# Altium project MB1428.PrjPcb (part 1 of 4)
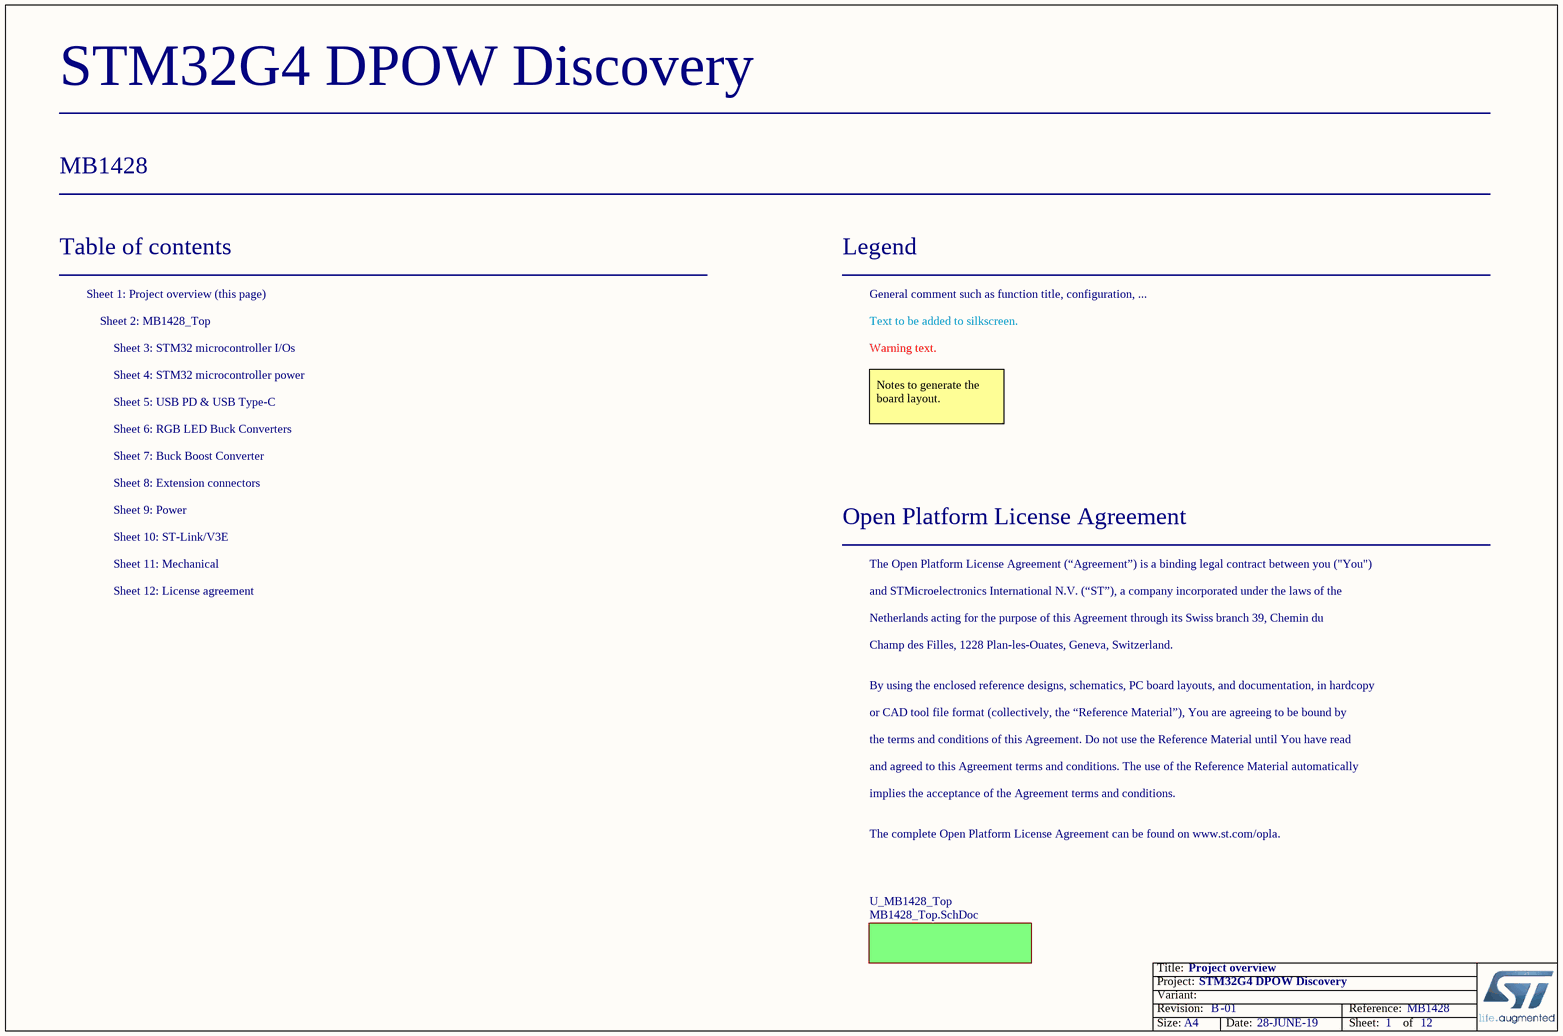
[diagram p0: Project_Overview.SchDoc]
Board_Assembly_Revision: 01; Board_Document_Date: 28-JUNE-19; Board_Name: STM32G4 DPOW Discovery; Board_PCB_Revision: B; Board_Reference: MB1428
11 sheets, 403 parts. Net scope: flat (ports and power ports of the same name join across sheets).
Board file: MB1428.PcbDoc
Sheets:
  Project_Overview.SchDoc
    U_MB1428_Top = MB1428_Top.SchDoc
      U_Extension_connectors = Extension_connectors.SchDoc
      U_Power = Power.SchDoc
      U_STM32_microcontroller_IOs = STM32_microcontroller_IOs.SchDoc
      U_STM32_microcontroller_power = STM32_microcontroller_power.SchDoc
      U_ST_LINK_V3E = ST_LINK_V3E.SchDoc
      Mechanical = Mechanical.SchDoc
      U_USB_PD_TYPE-C = USB_PD_TYPE-C.SchDoc
      U_RGB_LED_BUCK_Converters = RGB_LED_BUCK_Converters.SchDoc
      U_BUCK_BOOST_Converter = BUCK_BOOST_Converter.SchDoc

## Sheet Project_Overview.SchDoc: Project overview
size A4; Date: Not used; ApprovedBy: Not used; CheckedBy: Not used; Author: Not used; CompanyName: STMicroelectronics; DrawnBy: Not used; Engineer: Not used; Organization: Not used; Address1: Not used; Address2: Not used; Address3: Not used; Address4: Not used; DocumentNumber: Not used; Revision: Not used; SheetNumber: 1; SheetTotal: 12; CurrentTime: Not used; CurrentDate: Not used; Time: Not used; DocumentFullPathAndName: Not used; DocumentName: Not used; ModifiedDate: Not used; ImagePath: Not used; ProjectName: Not used; Application_BuildNumber: Not used

### Sub-sheets
U_MB1428_Top = MB1428_Top.SchDoc: no entries

### Notes on the sheet
- Table of contents
- Sheet 1: Project overview (this page)
- Legend
- General comment such as function title, configuration, ...
- Sheet 2: MB1428_Top
- Sheet 3: STM32 microcontroller I/Os
- Sheet 4: STM32 microcontroller power
- Text to be added to silkscreen.
- Warning text.
- Sheet 6: RGB LED Buck Converters
- Sheet 5: USB PD & USB Type-C
- Notes to generate the board layout.
- Sheet 9: Power
- Sheet 8: Extension connectors
- Sheet 7: Buck Boost Converter
- Sheet 10: ST-Link/V3E
- Sheet 11: Mechanical
- Open Platform License Agreement
- The Open Platform License Agreement (“Agreement”) is a binding legal contract between you ("You")
- Sheet 12: License agreement
- and STMicroelectronics International N.V. (“ST”), a company incorporated under the laws of the
- Netherlands acting for the purpose of this Agreement through its Swiss branch 39, Chemin du
- Champ des Filles, 1228 Plan-les-Ouates, Geneva, Switzerland.
- By using the enclosed reference designs, schematics, PC board layouts, and documentation, in hardcopy
- or CAD tool file format (collectively, the “Reference Material”), You are agreeing to be bound by
- the terms and conditions of this Agreement. Do not use the Reference Material until You have read
- and agreed to this Agreement terms and conditions. The use of the Reference Material automatically
- implies the acceptance of the Agreement terms and conditions.
- The complete Open Platform License Agreement can be found on www.st.com/opla.
- Title:
- Project:
- Size:
- Revision:
- Variant:
- A4
- -
- Date:
- Reference:
- Sheet:
- of

## Sheet MB1428_Top.SchDoc: MB1428_Top
size A4; Date: Not used; ApprovedBy: Not used; CheckedBy: Not used; Author: Not used; CompanyName: STMicroelectronics; DrawnBy: Not used; Engineer: Not used; Organization: Not used; Address1: Not used; Address2: Not used; Address3: Not used; Address4: Not used; DocumentNumber: Not used; Revision: Not used; SheetNumber: 2; SheetTotal: 12; CurrentTime: Not used; CurrentDate: Not used; Time: Not used; DocumentFullPathAndName: Not used; DocumentName: Not used; ModifiedDate: Not used; ImagePath: Not used; ProjectName: Not used; Application_BuildNumber: Not used
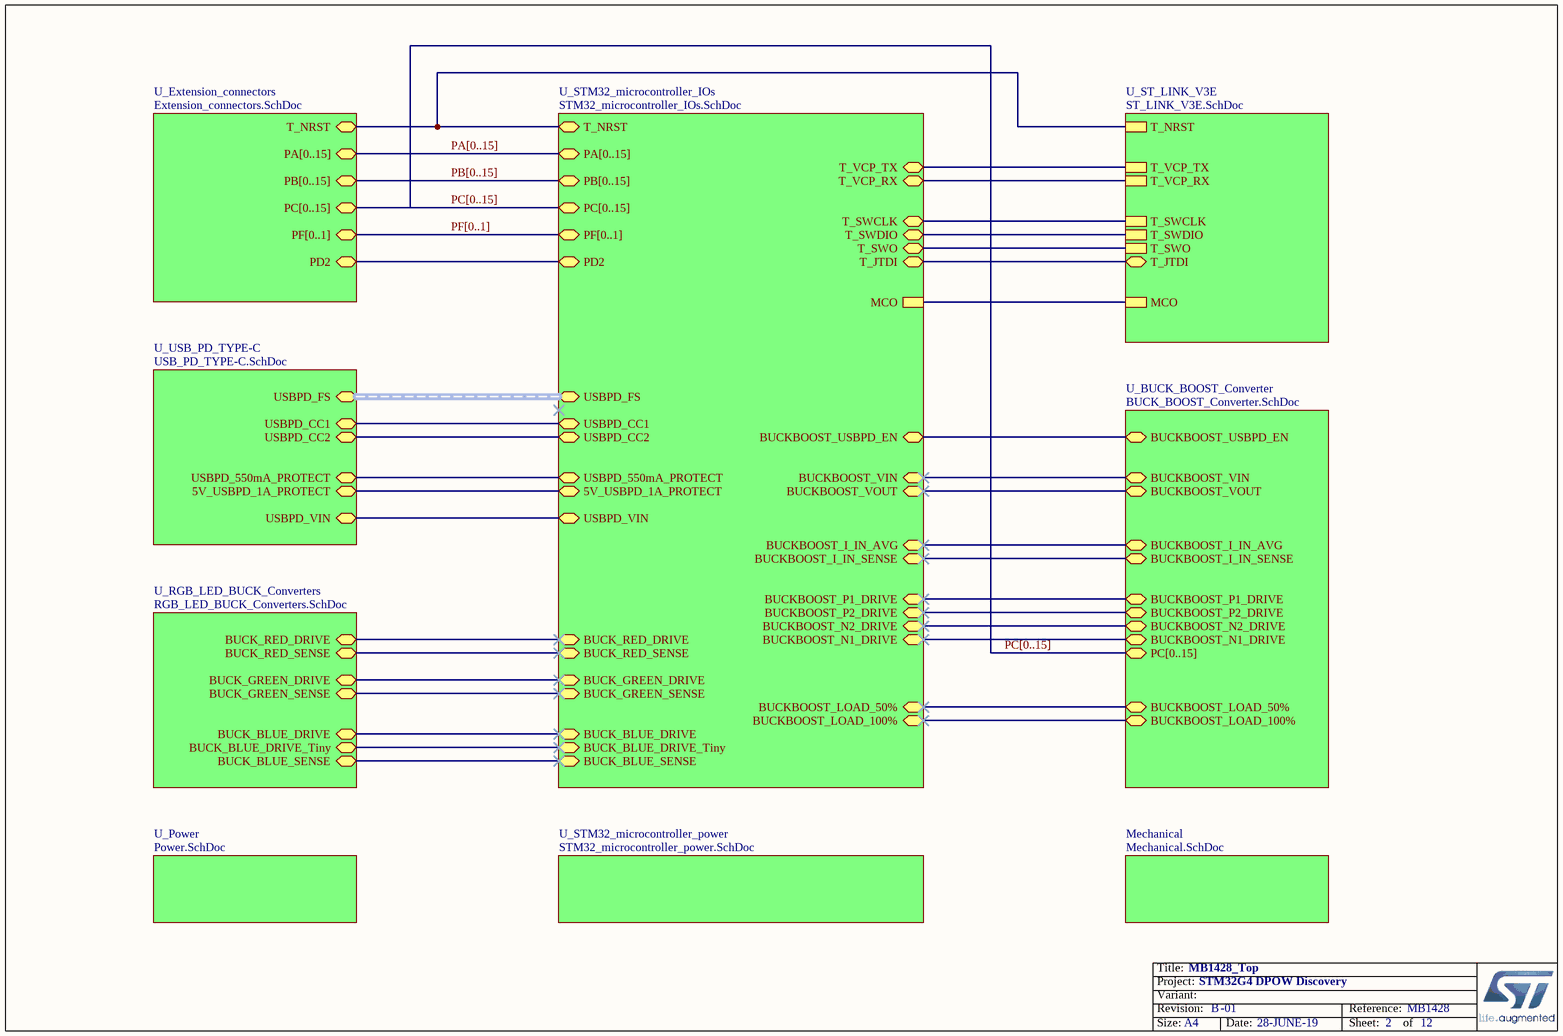
[diagram p1: MB1428_Top.SchDoc]

### Sub-sheets
Mechanical = Mechanical.SchDoc: no entries
U_BUCK_BOOST_Converter = BUCK_BOOST_Converter.SchDoc: PC[0..15] (bidir), BUCKBOOST_USBPD_EN, BUCKBOOST_VOUT, BUCKBOOST_VIN, BUCKBOOST_I_IN_SENSE, BUCKBOOST_I_IN_AVG, BUCKBOOST_P2_DRIVE, BUCKBOOST_P1_DRIVE, BUCKBOOST_N1_DRIVE, BUCKBOOST_N2_DRIVE, BUCKBOOST_LOAD_100%, BUCKBOOST_LOAD_50%
U_Extension_connectors = Extension_connectors.SchDoc: PA[0..15] (bidir), PB[0..15] (bidir), PC[0..15] (bidir), PF[0..1] (bidir), T_NRST, PD2
U_Power = Power.SchDoc: no entries
U_RGB_LED_BUCK_Converters = RGB_LED_BUCK_Converters.SchDoc: BUCK_GREEN_SENSE, BUCK_RED_DRIVE, BUCK_RED_SENSE, BUCK_GREEN_DRIVE, BUCK_BLUE_DRIVE, BUCK_BLUE_DRIVE_Tiny, BUCK_BLUE_SENSE
U_ST_LINK_V3E = ST_LINK_V3E.SchDoc: T_SWCLK, T_SWO, T_NRST, MCO, T_SWDIO, T_VCP_TX, T_VCP_RX, T_JTDI
U_STM32_microcontroller_IOs = STM32_microcontroller_IOs.SchDoc: PA[0..15] (bidir), PB[0..15] (bidir), PC[0..15] (bidir), PF[0..1] (bidir), MCO, PD2, T_NRST, T_VCP_TX, T_VCP_RX, T_SWCLK, T_SWO, T_SWDIO, T_JTDI, BUCKBOOST_USBPD_EN, BUCKBOOST_VIN, BUCKBOOST_VOUT, BUCKBOOST_I_IN_AVG, BUCKBOOST_I_IN_SENSE, BUCKBOOST_P2_DRIVE, BUCKBOOST_P1_DRIVE, BUCKBOOST_N1_DRIVE, BUCKBOOST_N2_DRIVE, BUCKBOOST_LOAD_100%, BUCKBOOST_LOAD_50%, USBPD_CC1, USBPD_CC2, 5V_USBPD_1A_PROTECT, USBPD_550mA_PROTECT, BUCK_GREEN_SENSE, BUCK_RED_DRIVE, BUCK_RED_SENSE, BUCK_GREEN_DRIVE, BUCK_BLUE_DRIVE, BUCK_BLUE_DRIVE_Tiny, BUCK_BLUE_SENSE, USBPD_FS (harness USBPDFS), USBPD_VIN
U_STM32_microcontroller_power = STM32_microcontroller_power.SchDoc: no entries
U_USB_PD_TYPE-C = USB_PD_TYPE-C.SchDoc: 5V_USBPD_1A_PROTECT, USBPD_CC1, USBPD_CC2, USBPD_550mA_PROTECT, USBPD_FS (harness USBPDFS), USBPD_VIN

### Nets
(unnamed): sheet U_Extension_connectors/T_NRST, sheet U_STM32_microcontroller_IOs/T_NRST, sheet U_ST_LINK_V3E/T_NRST
(unnamed): sheet U_Extension_connectors/PD2, sheet U_STM32_microcontroller_IOs/PD2
(unnamed): sheet U_STM32_microcontroller_IOs/MCO, sheet U_ST_LINK_V3E/MCO
(unnamed): sheet U_STM32_microcontroller_IOs/T_VCP_TX, sheet U_ST_LINK_V3E/T_VCP_TX
(unnamed): sheet U_STM32_microcontroller_IOs/T_VCP_RX, sheet U_ST_LINK_V3E/T_VCP_RX
(unnamed): sheet U_STM32_microcontroller_IOs/T_SWCLK, sheet U_ST_LINK_V3E/T_SWCLK
(unnamed): sheet U_STM32_microcontroller_IOs/T_SWO, sheet U_ST_LINK_V3E/T_SWO
(unnamed): sheet U_STM32_microcontroller_IOs/T_SWDIO, sheet U_ST_LINK_V3E/T_SWDIO
(unnamed): sheet U_STM32_microcontroller_IOs/T_JTDI, sheet U_ST_LINK_V3E/T_JTDI
(unnamed): sheet U_STM32_microcontroller_IOs/BUCKBOOST_USBPD_EN, sheet U_BUCK_BOOST_Converter/BUCKBOOST_USBPD_EN
(unnamed): sheet U_STM32_microcontroller_IOs/BUCKBOOST_VIN, sheet U_BUCK_BOOST_Converter/BUCKBOOST_VIN
(unnamed): sheet U_STM32_microcontroller_IOs/BUCKBOOST_VOUT, sheet U_BUCK_BOOST_Converter/BUCKBOOST_VOUT
(unnamed): sheet U_STM32_microcontroller_IOs/BUCKBOOST_I_IN_AVG, sheet U_BUCK_BOOST_Converter/BUCKBOOST_I_IN_AVG
(unnamed): sheet U_STM32_microcontroller_IOs/BUCKBOOST_I_IN_SENSE, sheet U_BUCK_BOOST_Converter/BUCKBOOST_I_IN_SENSE
(unnamed): sheet U_STM32_microcontroller_IOs/BUCKBOOST_P2_DRIVE, sheet U_BUCK_BOOST_Converter/BUCKBOOST_P2_DRIVE
(unnamed): sheet U_STM32_microcontroller_IOs/BUCKBOOST_P1_DRIVE, sheet U_BUCK_BOOST_Converter/BUCKBOOST_P1_DRIVE
(unnamed): sheet U_STM32_microcontroller_IOs/BUCKBOOST_N1_DRIVE, sheet U_BUCK_BOOST_Converter/BUCKBOOST_N1_DRIVE
(unnamed): sheet U_STM32_microcontroller_IOs/BUCKBOOST_N2_DRIVE, sheet U_BUCK_BOOST_Converter/BUCKBOOST_N2_DRIVE
(unnamed): sheet U_STM32_microcontroller_IOs/BUCKBOOST_LOAD_100%, sheet U_BUCK_BOOST_Converter/BUCKBOOST_LOAD_100%
(unnamed): sheet U_STM32_microcontroller_IOs/BUCKBOOST_LOAD_50%, sheet U_BUCK_BOOST_Converter/BUCKBOOST_LOAD_50%
(unnamed): sheet U_STM32_microcontroller_IOs/USBPD_CC1, sheet U_USB_PD_TYPE-C/USBPD_CC1
(unnamed): sheet U_STM32_microcontroller_IOs/USBPD_CC2, sheet U_USB_PD_TYPE-C/USBPD_CC2
(unnamed): sheet U_STM32_microcontroller_IOs/5V_USBPD_1A_PROTECT, sheet U_USB_PD_TYPE-C/5V_USBPD_1A_PROTECT
(unnamed): sheet U_STM32_microcontroller_IOs/USBPD_550mA_PROTECT, sheet U_USB_PD_TYPE-C/USBPD_550mA_PROTECT
(unnamed): sheet U_STM32_microcontroller_IOs/BUCK_GREEN_SENSE, sheet U_RGB_LED_BUCK_Converters/BUCK_GREEN_SENSE
(unnamed): sheet U_STM32_microcontroller_IOs/BUCK_RED_DRIVE, sheet U_RGB_LED_BUCK_Converters/BUCK_RED_DRIVE
(unnamed): sheet U_STM32_microcontroller_IOs/BUCK_RED_SENSE, sheet U_RGB_LED_BUCK_Converters/BUCK_RED_SENSE
(unnamed): sheet U_STM32_microcontroller_IOs/BUCK_GREEN_DRIVE, sheet U_RGB_LED_BUCK_Converters/BUCK_GREEN_DRIVE
(unnamed): sheet U_STM32_microcontroller_IOs/BUCK_BLUE_DRIVE, sheet U_RGB_LED_BUCK_Converters/BUCK_BLUE_DRIVE
(unnamed): sheet U_STM32_microcontroller_IOs/BUCK_BLUE_DRIVE_Tiny, sheet U_RGB_LED_BUCK_Converters/BUCK_BLUE_DRIVE_Tiny
(unnamed): sheet U_STM32_microcontroller_IOs/BUCK_BLUE_SENSE, sheet U_RGB_LED_BUCK_Converters/BUCK_BLUE_SENSE
(unnamed): sheet U_STM32_microcontroller_IOs/USBPD_VIN, sheet U_USB_PD_TYPE-C/USBPD_VIN

### Buses and harness runs
bus PA[0..15] = sheet U_Extension_connectors/PA[0..15] = sheet U_STM32_microcontroller_IOs/PA[0..15]
bus PB[0..15] = sheet U_Extension_connectors/PB[0..15] = sheet U_STM32_microcontroller_IOs/PB[0..15]
bus PC[0..15] = sheet U_BUCK_BOOST_Converter/PC[0..15] = sheet U_Extension_connectors/PC[0..15] = sheet U_STM32_microcontroller_IOs/PC[0..15]
bus PF[0..1] = sheet U_Extension_connectors/PF[0..1] = sheet U_STM32_microcontroller_IOs/PF[0..1]
harness sheet U_STM32_microcontroller_IOs/USBPD_FS = sheet U_USB_PD_TYPE-C/USBPD_FS

### Notes on the sheet
- Cuttable part on PCB
- Title:
- Project:
- Size:
- Revision:
- Variant:
- A4
- -
- Date:
- Reference:
- Sheet:
- of

## Sheet Extension_connectors.SchDoc: Extension_connectors
size A4; Date: Not used; ApprovedBy: Not used; CheckedBy: Not used; Author: Not used; CompanyName: STMicroelectronics; DrawnBy: Not used; Engineer: Not used; Organization: Not used; Address1: Not used; Address2: Not used; Address3: Not used; Address4: Not used; DocumentNumber: Not used; Revision: Not used; SheetNumber: 8; SheetTotal: 12; CurrentTime: Not used; CurrentDate: Not used; Time: Not used; DocumentFullPathAndName: Not used; DocumentName: Not used; ModifiedDate: Not used; ImagePath: Not used; ProjectName: Not used; Application_BuildNumber: Not used
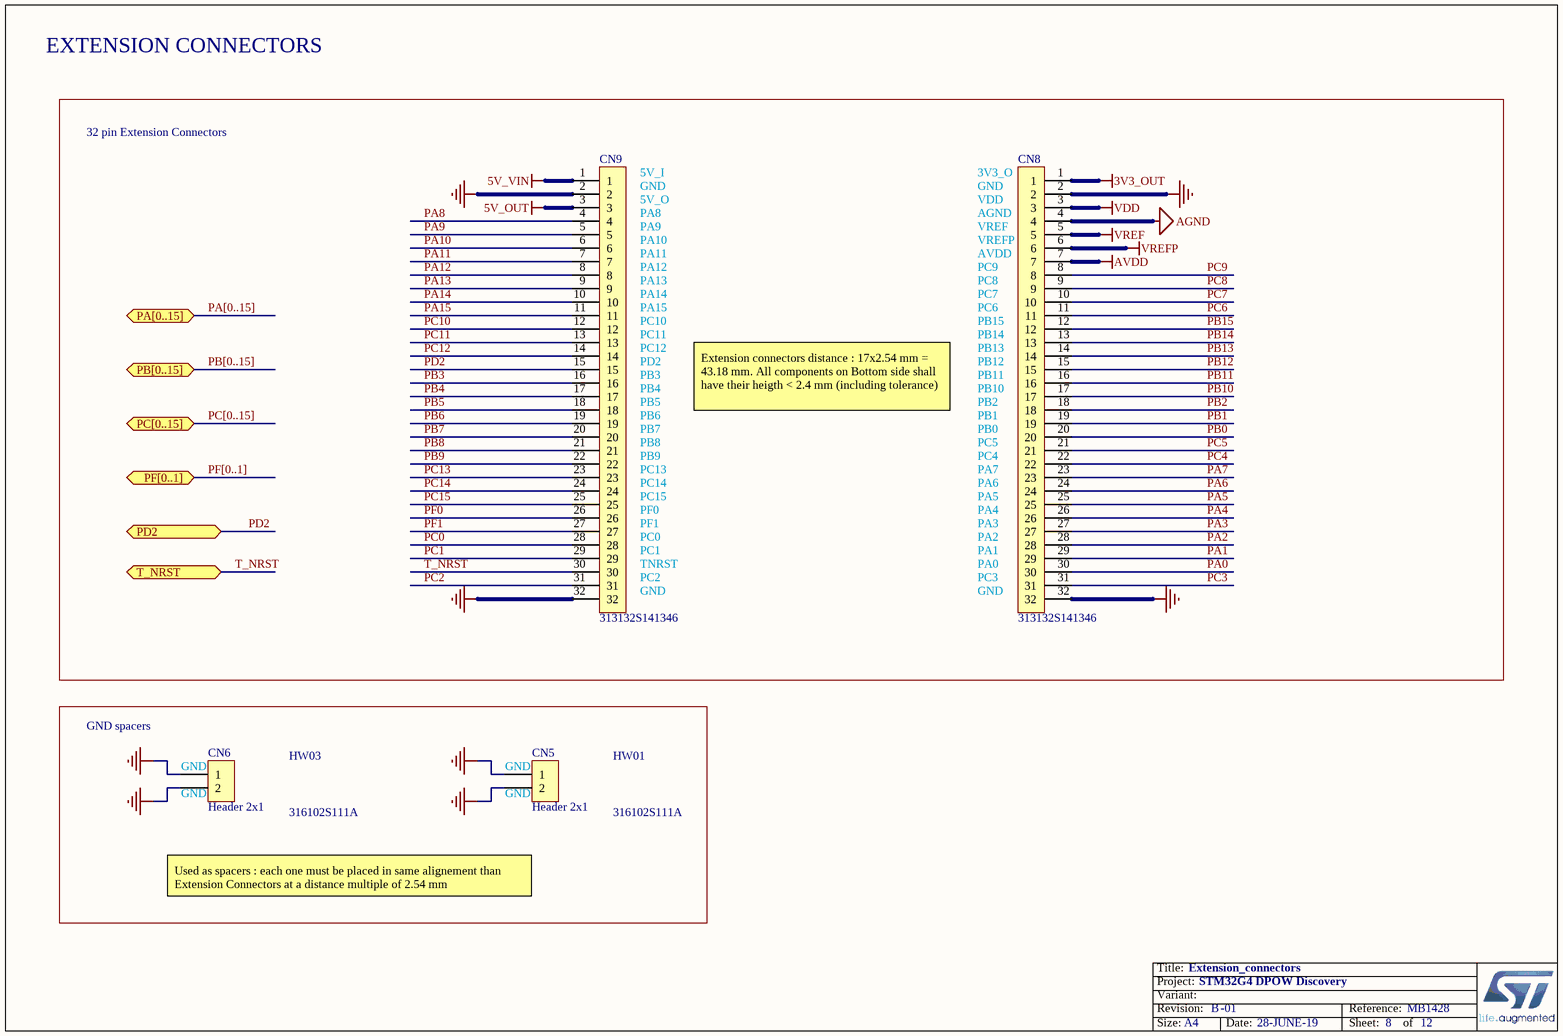
[diagram p2: Extension_connectors.SchDoc]

### Parts
CN5  Header 2x1  [CON_LYCONN_313102S141346]
CN6  Header 2x1  [CON_LYCONN_313102S141346]
CN8  value 313132S141346  [CON_LYCONN_313132S141346]  (hidden comment: Header 32x1)
CN9  value 313132S141346  [CON_LYCONN_313132S141346]  (hidden comment: Header 32x1)
HW01  value 316102S111A  (hidden comment: JUMPER_OPEN)
HW03  value 316102S111A  (hidden comment: JUMPER_OPEN)

### Ports
PA[0..15] (bidir), PB[0..15] (bidir), PC[0..15] (bidir), PD2, PF[0..1] (bidir), T_NRST

### Nets
3V3_OUT: CN8.1
5V_OUT: CN9.3
5V_VIN: CN9.1
AGND: CN8.4
AVDD: CN8.7
GND: CN5.1 CN5.2 CN6.1 CN6.2 CN8.2 CN8.32 CN9.2 CN9.32
VDD: CN8.3
VREF: CN8.5
VREFP: CN8.6
PA0: CN8.30  [project net BUCK_GREEN_SENSE]
PA1: CN8.29  [project net BUCKBOOST_VIN]
PA2: CN8.28
PA3: CN8.27  [project net BUCKBOOST_VOUT]
PA4: CN8.26
PA5: CN8.25
PA6: CN8.24
PA7: CN8.23  [project net BUCK_RED_SENSE]
PA8: CN9.4  [project net BUCK_BLUE_DRIVE]
PA9: CN9.5
PA10: CN9.6
PA11: CN9.7
PA12: CN9.8
PA13: CN9.9
PA14: CN9.10
PA15: CN9.11
PB0: CN8.20  [project net BUCK_BLUE_SENSE]
PB1: CN8.19
PB2: CN8.18
PB3: CN9.16
PB4: CN9.17
PB5: CN9.18
PB6: CN9.19
PB7: CN9.20
PB8: CN9.21
PB9: CN9.22
PB10: CN8.17
PB11: CN8.16
PB12: CN8.15  [project net BUCKBOOST_P1_DRIVE]
PB13: CN8.14  [project net BUCKBOOST_N1_DRIVE]
PB14: CN8.13  [project net BUCKBOOST_N2_DRIVE]
PB15: CN8.12  [project net BUCKBOOST_P2_DRIVE]
PC0: CN9.28
PC1: CN9.29
PC2: CN9.31
PC3: CN8.31
PC4: CN8.22
PC5: CN8.21
PC6: CN8.11  [project net BUCK_RED_DRIVE]
PC7: CN8.10
PC8: CN8.9  [project net BUCK_GREEN_DRIVE]
PC9: CN8.8  [project net BUCK_BLUE_DRIVE_Tiny]
PC10: CN9.12
PC11: CN9.13
PC12: CN9.14
PC13: CN9.23
PC14: CN9.24  [project net BUCKBOOST_LOAD_50%]
PC15: CN9.25  [project net BUCKBOOST_LOAD_100%]
PD2: CN9.15 ; port PD2
PF0: CN9.26
PF1: CN9.27
T_NRST: CN9.30 ; port T_NRST

### Buses and harness runs
bus PA[0..15] = port PA[0..15]
bus PB[0..15] = port PB[0..15]
bus PC[0..15] = port PC[0..15]
bus PF[0..1] = port PF[0..1]

### Notes on the sheet
- EXTENSION CONNECTORS
- 32 pin Extension Connectors
- (near CN9) 5V_I
- (near CN8) 3V3_O
- (near CN9) GND
- (near CN9) 5V_O
- (near CN9) PA8
- (near CN9) PA10
- (near CN9) PA9
- (near CN8) GND
- (near CN8) VDD
- (near CN8) VREF
- (near CN8) AGND
- (near CN8) VREFP
- (near CN9) PA15
- (near CN9) PA14
- (near CN9) PA13
- (near CN9) PA12
- (near CN9) PA11
- (near CN8) AVDD
- (near CN8) PC6
- (near CN8) PC7
- (near CN8) PC8
- (near CN8) PC9
- (near CN9) PB3
- (near CN9) PD2
- (near CN9) PC12
- (near CN9) PC11
- (near CN9) PC10
- (near CN8) PB11
- (near CN8) PB12
- (near CN8) PB13
- (near CN8) PB14
- (near CN8) PB15
- (near CN9) PB7
- (near CN9) PB8
- (near CN9) PB6
- (near CN9) PB5
- (near CN9) PB4
- Extension connectors distance : 17x2.54 mm = 43.18 mm. All components on Bottom side shall have their heigth < 2.4 mm (including tolerance)
- (near CN8) PC5
- (near CN8) PB0
- (near CN8) PB1
- (near CN8) PB2
- (near CN8) PB10
- (near CN9) PF0
- (near CN9) PC15
- (near CN9) PC14
- (near CN9) PC13
- (near CN9) PB9
- (near CN8) PA4
- (near CN8) PA5
- (near CN8) PA6
- (near CN8) PA7
- (near CN8) PC4
- (near CN9) TNRST
- (near CN9) PC2
- (near CN9) PC1
- (near CN9) PC0
- (near CN9) PF1
- (near CN8) PC3
- (near CN8) PA0
- (near CN8) PA1
- (near CN8) PA2
- (near CN8) PA3
- GND spacers
- (near CN6) GND
- (near CN5) GND
- Used as spacers : each one must be placed in same alignement than Extension Connectors at a distance multiple of 2.54 mm
- Title:
- Project:
- Size:
- Revision:
- Variant:
- A4
- -
- Date:
- Reference:
- Sheet:
- of

### Library data of the parts
CN5 CN6 = MCD-01668: Header 2x1, 2.54mm, VR, TH, height 5.84mm/5.08 mm, height total 13.46 mm; Part_Type: Connector; Manufacturer_Part_Number: 313102S141346; Manufacturer: LYCONN; Provided_By: SUBCO; Internal_Part_Number: MCD-01668; Value: Header 2x1; Status: Footprint available; ComponentLink1Description: Datasheet; ComponentLink1URL: http://tunmcdsvn.tun.st.com/Component_Datasheet_Library/Trunk/Connectors/LYCONN_31XXX_2.54mm_L13.46mm/LYCONN_31XXX_2.54mm_L13.46mm.pdf
CN8 CN9 = MCD-01728: 'Header 32x1, 2.54mm, VR, TH, height 5.84mm/5.08 mm, height total 13.46 mm; Part_Type: Connector; Manufacturer: LYCONN; Internal_Part_Number: MCD-01728; Status: Footprint available; Manufacturer_Part_Number: 313132S141346; ComponentLink1Description: Datasheet; ComponentLink1URL: http://tunmcdsvn.tun.st.com/Component_Datasheet_Library/Trunk/Connectors/LYCONN_31XXX_2.54mm_L13.46mm/LYCONN_31XXX_2.54mm_L13.46mm.pdf; Provided_By: n/a
HW01 HW03 = MCD-01849: Jumper, height 6mm, Black, 2.54mm, 3A, 20 mohm, open; Part_Type: Mechanical; Manufacturer: JIUBABA; Provided_By: SUBCO; Internal_Part_Number: MCD-01849; Status: Footprint available; Manufacturer_Part_Number: 316102S111A; ComponentLink1Description: Datasheet; ComponentLink1URL: http://tunmcdsvn.tun.st.com/Component_Datasheet_Library/Trunk/Mechanical/JIUBABA_316102S111A_Jumper_open_2.54mm/JIUBABA_316102S111A_Jumper_open__2.54mm.pdf; ECCN_US: n/a; ECCN_EU: n/a

## Sheet Power.SchDoc: Power
size A4; Date: Not used; ApprovedBy: Not used; CheckedBy: Not used; Author: Not used; CompanyName: STMicroelectronics; DrawnBy: Not used; Engineer: Not used; Organization: Not used; Address1: Not used; Address2: Not used; Address3: Not used; Address4: Not used; DocumentNumber: Not used; Revision: Not used; SheetNumber: 9; SheetTotal: 12; CurrentTime: Not used; CurrentDate: Not used; Time: Not used; DocumentFullPathAndName: Not used; DocumentName: Not used; ModifiedDate: Not used; ImagePath: Not used; ProjectName: Not used; Application_BuildNumber: Not used
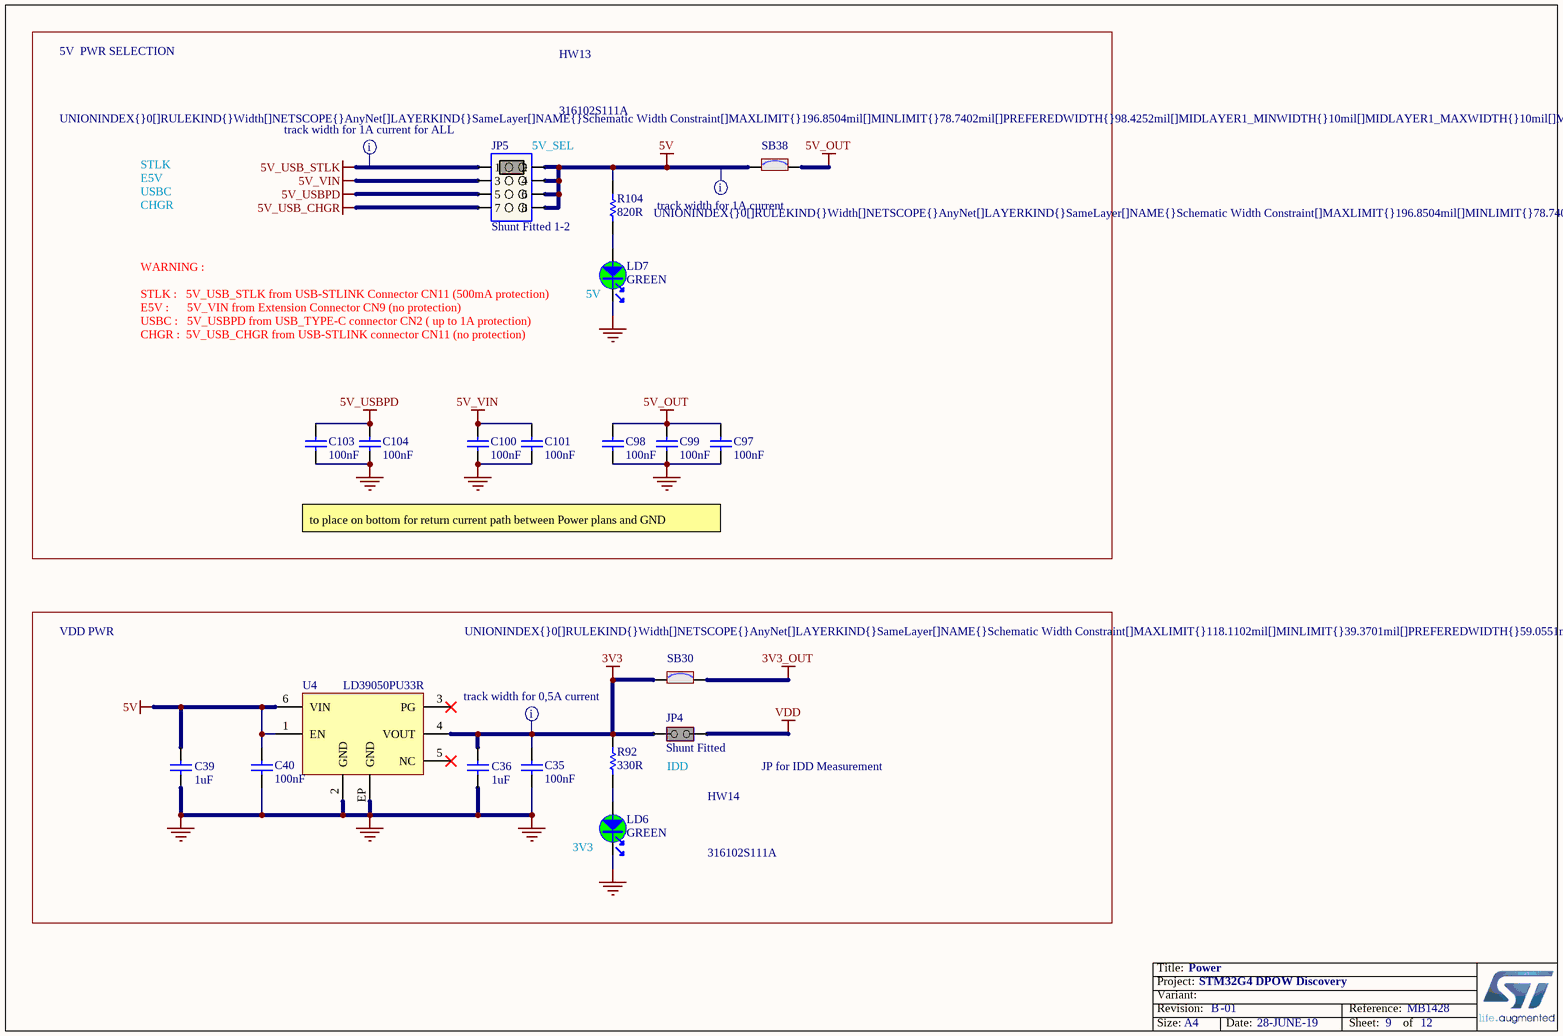
[diagram p3: Power.SchDoc]

### Parts
C35  value 100nF  [C0402]
C36  value 1uF  [C0603]
C39  value 1uF  [C0603]
C40  value 100nF  [C0402]
C97  value 100nF  [C0402]
C98  value 100nF  [C0402]
C99  value 100nF  [C0402]
C100  value 100nF  [C0402]
C101  value 100nF  [C0402]
C103  value 100nF  [C0402]
C104  value 100nF  [C0402]
HW13  value 316102S111A  (hidden comment: JUMPER_OPEN)
HW14  value 316102S111A  (hidden comment: JUMPER_OPEN)
JP4  value Shunt Fitted  [CON_988-JIUBABA_313102S111116]  (hidden comment: Jumper_Header 2x1 Fitted)
JP5  value Shunt Fitted 1-2  [CON_988-JIUBABA_313208S141116]  (hidden comment: Jumper_Header 4x2 Fitted 1-2)
LD6  value GREEN  [LED_0603_GREEN]
LD7  value GREEN  [LED_0603_GREEN]
R92  value 330R  [R0603]
R104  value 820R  [R0603]
SB30  (no value)  [SOLDER-BRIDGE_R0603-0R]
SB38  (no value)  [SOLDER-BRIDGE_R0603-0R]
U4  value LD39050PU33R  [ICC_DFN6-EPAD_3X3_P095]

### Nets
3V3: C35.2 C36.2 JP4.1(COMMON) R92.2 SB30.1 U4.4(VOUT)
3V3_OUT: SB30.2
5V: C39.2 C40.2 JP5.2 JP5.4 JP5.6 JP5.8 R104.2 SB38.1 U4.1(EN) U4.6(VIN)
5V_OUT: C97.2 C98.2 C99.2 SB38.2
5V_USB_CHGR: JP5.7
5V_USB_STLK: JP5.1
5V_USBPD: C103.2 C104.2 JP5.5
5V_VIN: C100.2 C101.2 JP5.3
GND: C35.1 C36.1 C39.1 C40.1 C97.1 C98.1 C99.1 C100.1 C101.1 C103.1 C104.1 LD6.2 LD7.2 U4.2(GND) U4.EP(GND)
VDD: JP4.2(NO)
NetLD6_1: LD6.1 R92.1
NetLD7_1: LD7.1 R104.1

Not connected (* = marked no-connect by the designer): U4 3(PG)* 5(NC)*

### Layout directives
rule Width Constraint [Pref Width = 2.5mm    Min Width = 2mm    Max Width = 5mm]: 5V, 5V_USB_STLK
rule Width Constraint [Pref Width = 1.5mm    Min Width = 1mm    Max Width = 3mm]: 3V3

### Notes on the sheet
- 5V  PWR SELECTION
- STLK
- E5V
- (near JP5) 5V_SEL
- USBC
- CHGR
- (near LD7) STLK :   5V_USB_STLK from USB-STLINK Connector CN11 (500mA protection)
- E5V :      5V_VIN from Extension Connector CN9 (no protection)
- WARNING :
- (near LD7) 5V
- USBC :   5V_USBPD from USB_TYPE-C connector CN2 ( up to 1A protection)
- CHGR :  5V_USB_CHGR from USB-STLINK connector CN11 (no protection)
- to place on bottom for return current path between Power plans and GND
- VDD PWR
- IDD
- JP for IDD Measurement
- (near LD6) 3V3
- Title:
- Project:
- Size:
- Revision:
- Variant:
- A4
- -
- Date:
- Reference:
- Sheet:
- of

### Library data of the parts
C35 C40 C97-C101 C103 C104 = MCD-00102: Capacitor, MLCC, 100nF, 16V, X7R, 10%, 0402, T=0,5mm; Manufacturer_Part_Number: CC0402KRX7R7BB104; Manufacturer: YAGEO; Alternate_Manufacturer_Part_Number: GCM155R71C104KA55D; Alternate_Manufacturer: MURATA; Provided_By: SUBCO; Internal_Part_Number: MCD-00102; Status: Released; Package: C0402; ComponentLink1Description: Datasheet; Part_Type: Capacitor; ComponentLink1URL: http://tunmcdsvn.tun.st.com/Component_Datasheet_Library/Trunk/Capacitors/Yageo_Multilayer_Capacitor_X7R_series_100pF_to_22uF
C36 C39 = MCD-00010: Capacitor, MLCC, 1uF, 16V, X5R, 10%, 0603, T=0,8mm; Manufacturer_Part_Number: CC0603KRX5R7BB105; Manufacturer: YAGEO; Provided_By: SUBCO; Internal_Part_Number: MCD-00010; Status: Released; Package: C0603; ComponentLink1Description: Datasheet; Part_Type: Capacitor; ComponentLink1URL: http://tunmcdsvn.tun.st.com/Component_Datasheet_Library/Trunk/Capacitors/Yageo_Multilayer_capacitor_X5R_series_100pF_to_100uF
HW13 HW14 = MCD-01849: as HW01 on sheet Extension_connectors; Internal_Part_Number: MCD-01849; Status: Footprint available; Manufacturer_Part_Number: 316102S111A; ComponentLink1Description: Datasheet; ComponentLink1URL: http://tunmcdsvn.tun.st.com/Component_Datasheet_Library/Trunk/Mechanical/JIUBABA_316102S111A_Jumper_open_2.54mm/JIUBABA_316102S111A_Jumper_open__2.54mm.pdf; ECCN_US: n/a; ECCN_EU: n/a
JP4 = MCD-01662: Header 2x1, 2.54mm, VR, TH, height 6 mm / 3 mm, total 11.6mm - Shunt Fitted by default; Part_Type: Connector; Manufacturer_Part_Number: 313102S111116; Manufacturer: JIUBABA; Provided_By: SUBCO; Internal_Part_Number: MCD-01662; Status: Footprint available; ComponentLink1Description: Datasheet; ComponentLink1URL: http://tunmcdsvn.tun.st.com/Component_Datasheet_Library/Trunk/Connectors/JIUBABA_31XXX_2.54mm_L11.6mm/JIUBABA_31XXX_2.54mm_L11.6mm.pdf
JP5 = MCD-01661: Header, 4x2, 2,54mm, VR, TH, Height 6mm/3m, total 11.6mm - Shunt Fitted 1-2; Part_Type: Connector; Manufacturer_Part_Number: 313208S141116; Manufacturer: JIUBABA; Provided_By: SUBCO; Internal_Part_Number: MCD-01661; Status: Footprint available; ComponentLink1Description: Datasheet; ComponentLink1URL: http://tunmcdsvn.tun.st.com/Component_Datasheet_Library/Trunk/Connectors/JIUBABA_31XXX_2.54mm_L11.6mm/JIUBABA_31XXX_2.54mm_L11.6mm.pdf
LD6 LD7 = MCD-00050: LED, Green, 0603; Manufacturer_Part_Number: 19-213SYGC/S530-E2/TR8; Manufacturer: EVERLIGHT; Part_Type: Display; Provided_By: SUBCO; Internal_Part_Number: MCD-00050; ComponentLink1Description: Datasheet; Status: Released; ComponentLink1URL: http://tunmcdsvn.tun.st.com/Component_Datasheet_Library/Trunk/Display/Everlight_SMD-LED-GREEN_19-213SYGC-S530-XX-TR8-v3.doc; Package: LED 0603
R92 = MCD-00197: Resistor,330R,0603,1%,1/10W; Manufacturer_Part_Number: RC0603FR-07330RL; Manufacturer: YAGEO; BMS_Part_Number: 9129729; Provided_By: SUBCO; Internal_Part_Number: MCD-00197; Status: Released; Part_Type: Resistor; Package: R0603; ComponentLink1Description: Datasheet; ComponentLink1URL: http://tunmcdsvn.tun.st.com/Component_Datasheet_Library/Trunk/Resistors/Yageo_Resistor_RC0603-series
R104 = MCD-00528: Resistor,820R,0603,1%,1/10W; Manufacturer_Part_Number: RC0603FR-07820RL; Manufacturer: YAGEO; BMS_Part_Number: 9129759; Provided_By: SUBCO; Internal_Part_Number: MCD-00528; Status: Released; Part_Type: Resistor; Package: R0603; ComponentLink1Description: Datasheet; ComponentLink1URL: http://tunmcdsvn.tun.st.com/Component_Datasheet_Library/Trunk/Resistors/Yageo_Resistor_RC0603-series
SB30 SB38 = MCD-00071: Solder Bridge ON; Part_Type: Mechanical; Manufacturer_Part_Number: RC0603JR-070RL; Manufacturer: YAGEO; Provided_By: SUBCO; Internal_Part_Number: MCD-00071; Status: Released; Package: SB0603; ComponentLink1Description: Datasheet; ComponentLink1URL: http://tunmcdsvn.tun.st.com/Component_Datasheet_Library/Trunk/Resistors/Yageo_Resistor_RC0603-series
U4 = MCD-00215: Low quiescent current and low noise voltage regulators; Manufacturer: STMICROELECTRONICS; Part_Type: IC; BMS_Part_Number: 9176126; Provided_By: SUBCO with ST control; Internal_Part_Number: MCD-00215; Manufacturer_Part_Number: LD39050PU33R; Status: Released; ComponentLink1Description: Datasheet; ComponentLink1URL: http://tunmcdsvn.tun.st.com/Component_Datasheet_Library/Trunk/IC/STM_LDO_LD39050PU; Package: DFN6 3x3mm

## Sheet STM32_microcontroller_IOs.SchDoc: STM32_microcontroller_IOs
size A3; Date: Not used; ApprovedBy: Not used; CheckedBy: Not used; Author: Not used; CompanyName: STMicroelectronics; DrawnBy: Not used; Engineer: Not used; Organization: Not used; Address1: Not used; Address2: Not used; Address3: Not used; Address4: Not used; DocumentNumber: Not used; Revision: Not used; SheetNumber: 3; SheetTotal: 12; CurrentTime: Not used; CurrentDate: Not used; Time: Not used; DocumentFullPathAndName: Not used; DocumentName: Not used; ModifiedDate: Not used; ImagePath: Not used; ProjectName: Not used; Application_BuildNumber: Not used
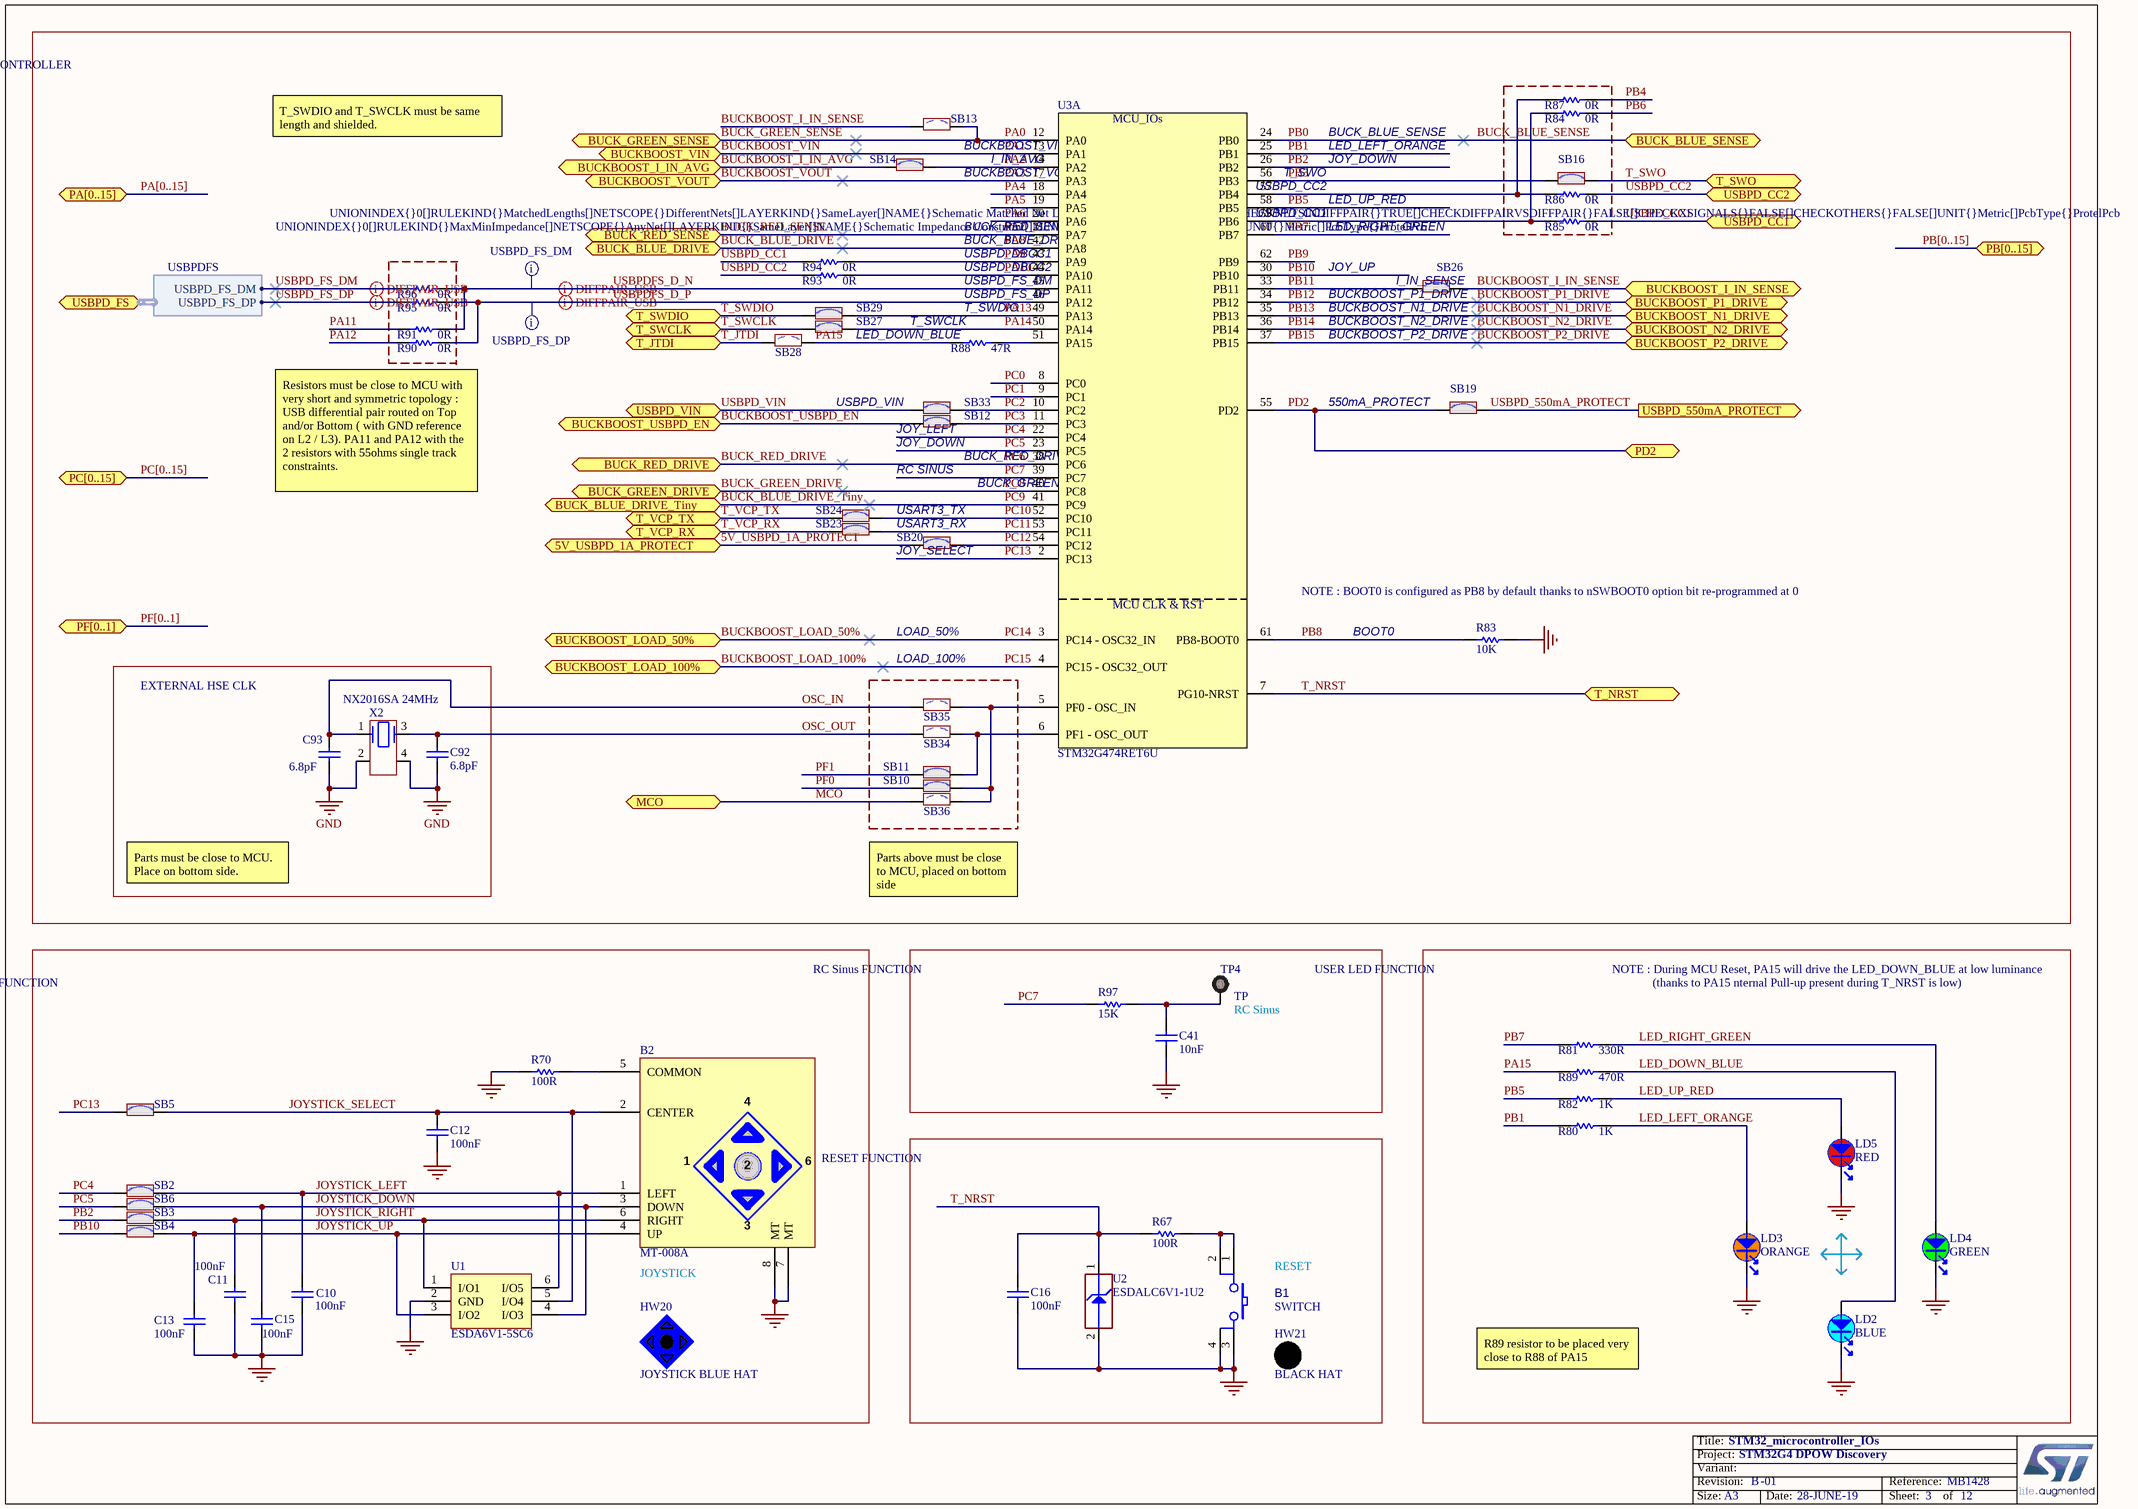
[diagram p4: STM32_microcontroller_IOs.SchDoc]

### Parts
B1  value SWITCH  [SWI_WEALTHMETAL_TD-0341_4P_BLACK]
B2  value MT-008A  [SWI_XIEJIA_MT-008A_6P]
C10  value 100nF  [C0402]
C11  value 100nF  [C0402]
C12  value 100nF  [C0402]
C13  value 100nF  [C0402]
C15  value 100nF  [C0402]
C16  value 100nF  [C0402]
C41  value 10nF  [C0603]
C92  value 6.8pF  [C0402]
C93  value 6.8pF  [C0402]
HW20  value JOYSTICK BLUE HAT  (hidden comment: JOYSTICK_BLUE_HAT)  (mechanical)
HW21  value BLACK HAT  (mechanical)
LD2  value BLUE  [LED_0603_SMD-B_BLUE_H0P4]
LD3  value ORANGE  [LED_0603_ORANGE_H0P4]
LD4  value GREEN  [LED_0603_GREEN]
LD5  value RED  [LED_0603_RED]
R67  value 100R  [R0603]
R70  value 100R  [R0603]
R80  value 1K  [R0603]
R81  value 330R  [R0603]
R82  value 1K  [R0603]
R83  value 10K  [R0603]
R84  value 0R  [R0402]
R85  value 0R  [R0402]
R86  value 0R  [R0402]
R87  value 0R  [R0402]
R88  value 47R  [R0402]
R89  value 470R  [R0603]
R90  value 0R  [R0402]
R91  value 0R  [R0402]
R93  value 0R  [R0402]
R94  value 0R  [R0402]
R95  value 0R  [R0402]
R96  value 0R  [R0402]
R97  value 15K  [R0603]
SB2  (no value)  [SOLDER-BRIDGE_R0603-0R]
SB3  (no value)  [SOLDER-BRIDGE_R0603-0R]
SB4  (no value)  [SOLDER-BRIDGE_R0603-0R]
SB5  (no value)  [SOLDER-BRIDGE_R0603-0R]
SB6  (no value)  [SOLDER-BRIDGE_R0603-0R]
SB10  (no value)  [SOLDER-BRIDGE_R0603-0R]
SB11  (no value)  [SOLDER-BRIDGE_R0603-0R]
SB12  (no value)  [SOLDER-BRIDGE_R0603-0R]
SB13  (no value)  [SOLDER-BRIDGE_R0603-0R]
SB14  (no value)  [SOLDER-BRIDGE_R0603-0R]
SB16  (no value)  [SOLDER-BRIDGE_R0603-0R]
SB19  (no value)  [SOLDER-BRIDGE_R0603-0R]
SB20  (no value)  [SOLDER-BRIDGE_R0603-0R]
SB23  (no value)  [SOLDER-BRIDGE_R0603-0R]
SB24  (no value)  [SOLDER-BRIDGE_R0603-0R]
SB26  (no value)  [SOLDER-BRIDGE_R0603-0R]
SB27  (no value)  [SOLDER-BRIDGE_R0603-0R]
SB28  (no value)  [SOLDER-BRIDGE_R0603-0R]
SB29  (no value)  [SOLDER-BRIDGE_R0603-0R]
SB33  (no value)  [SOLDER-BRIDGE_R0603-0R]
SB34  (no value)  [SOLDER-BRIDGE_R0603-0R]
SB35  (no value)  [SOLDER-BRIDGE_R0603-0R]
SB36  (no value)  [SOLDER-BRIDGE_R0603-0R]
TP4  value TP  [TP_PTH_1MM_2MM]
U1  value ESDA6V1-5SC6  [ESD_SOT23-6L]
U2  value ESDALC6V1-1U2  [ESD_ST0201]
U3  STM32G474RET6U  [ICC_LQFP64_10X10_P050]  (part A of 2)
X2  value NX2016SA 24MHz  [CRY_NX2016SA_4P]

### Blocks framed on the sheet
EXTERNAL HSE CLK: C92 C93 X2
LOAD_100%: SB10 SB11 SB34-SB36
USER LED FUNCTION: LD2-LD5 R80-R82 R89

### Ports
5V_USBPD_1A_PROTECT, BUCK_BLUE_DRIVE, BUCK_BLUE_DRIVE_Tiny, BUCK_BLUE_SENSE, BUCK_GREEN_DRIVE, BUCK_GREEN_SENSE, BUCK_RED_DRIVE, BUCK_RED_SENSE, BUCKBOOST_I_IN_AVG, BUCKBOOST_I_IN_SENSE, BUCKBOOST_LOAD_50%, BUCKBOOST_LOAD_100%, BUCKBOOST_N1_DRIVE, BUCKBOOST_N2_DRIVE, BUCKBOOST_P1_DRIVE, BUCKBOOST_P2_DRIVE, BUCKBOOST_USBPD_EN, BUCKBOOST_VIN, BUCKBOOST_VOUT, MCO, PA[0..15] (bidir), PB[0..15] (bidir), PC[0..15] (bidir), PD2, PF[0..1] (bidir), T_JTDI, T_NRST, T_SWCLK, T_SWDIO, T_SWO, T_VCP_RX, T_VCP_TX, USBPD_550mA_PROTECT, USBPD_CC1, USBPD_CC2, USBPD_FS (harness USBPDFS), USBPD_VIN

### Harnesses
USBPDFS: USBPD_FS_DM, USBPD_FS_DP

### Nets
GND: B1.3 B1.4 B2.7(MT) B2.8(MT) C10.1 C11.1 C12.1 C13.1 C15.1 C16.1 C41.1 C92.1 C93.1 LD2.2 LD3.2 LD4.2 LD5.2 R70.1 R83.1 U1.2(GND) U2.2(GND) X2.2 X2.4
5V_USBPD_1A_PROTECT: SB20.1 ; port 5V_USBPD_1A_PROTECT
BUCK_BLUE_DRIVE: U3.42(PA8) ; port BUCK_BLUE_DRIVE  [also labelled PA8]
BUCK_BLUE_DRIVE_Tiny: U3.41(PC9) ; port BUCK_BLUE_DRIVE_Tiny  [also labelled PC9]
BUCK_BLUE_SENSE: U3.24(PB0) ; port BUCK_BLUE_SENSE  [also labelled PB0]
BUCK_GREEN_DRIVE: U3.40(PC8) ; port BUCK_GREEN_DRIVE  [also labelled PC8]
BUCK_GREEN_SENSE: SB13.2 U3.12(PA0) ; port BUCK_GREEN_SENSE  [also labelled PA0]
BUCK_RED_DRIVE: U3.38(PC6) ; port BUCK_RED_DRIVE  [also labelled PC6]
BUCK_RED_SENSE: U3.21(PA7) ; port BUCK_RED_SENSE  [also labelled PA7]
BUCKBOOST_I_IN_AVG: SB13.1 SB14.1 SB26.2 ; port BUCKBOOST_I_IN_SENSE, port BUCKBOOST_I_IN_AVG  [also labelled BUCKBOOST_I_IN_SENSE]
BUCKBOOST_LOAD_50%: U3.3(PC14_-_OSC32_IN) ; port BUCKBOOST_LOAD_50%  [also labelled PC14]
BUCKBOOST_LOAD_100%: U3.4(PC15_-_OSC32_OUT) ; port BUCKBOOST_LOAD_100%  [also labelled PC15]
BUCKBOOST_N1_DRIVE: U3.35(PB13) ; port BUCKBOOST_N1_DRIVE  [also labelled PB13]
BUCKBOOST_N2_DRIVE: U3.36(PB14) ; port BUCKBOOST_N2_DRIVE  [also labelled PB14]
BUCKBOOST_P1_DRIVE: U3.34(PB12) ; port BUCKBOOST_P1_DRIVE  [also labelled PB12]
BUCKBOOST_P2_DRIVE: U3.37(PB15) ; port BUCKBOOST_P2_DRIVE  [also labelled PB15]
BUCKBOOST_USBPD_EN: SB12.1 ; port BUCKBOOST_USBPD_EN
BUCKBOOST_VIN: U3.13(PA1) ; port BUCKBOOST_VIN  [also labelled PA1]
BUCKBOOST_VOUT: U3.17(PA3) ; port BUCKBOOST_VOUT  [also labelled PA3]
JOYSTICK_DOWN: B2.3(DOWN) C15.2 SB6.2 U1.4(I/O3)
JOYSTICK_LEFT: B2.1(LEFT) C10.2 SB2.1 U1.6(I/O5)
JOYSTICK_RIGHT: B2.6(RIGHT) C11.2 SB3.1 U1.1(I/O1)
JOYSTICK_SELECT: B2.2(CENTER) C12.2 SB5.2 U1.5(I/O4)
JOYSTICK_UP: B2.4(UP) C13.2 SB4.1 U1.3(I/O2)
LED_DOWN_BLUE: LD2.1 R89.2
LED_LEFT_ORANGE: LD3.1 R80.1
LED_RIGHT_GREEN: LD4.1 R81.1
LED_UP_RED: LD5.1 R82.1
MCO: SB36.1 ; port MCO
OSC_IN: C93.2 SB35.1 X2.1
OSC_OUT: C92.2 SB34.1 X2.3
PA2: SB14.2 U3.14(PA2)
PA4: U3.18(PA4)
PA5: U3.19(PA5)
PA6: U3.20(PA6)
PA9: R94.2 U3.43(PA9)
PA10: R93.2 U3.44(PA10)
PA11: R91.1
PA12: R90.1
PA13: SB29.2 U3.49(PA13)
PA14: SB27.2 U3.50(PA14)
PA15: R88.1 R89.1 SB28.2
PB1: R80.2 U3.25(PB1)
PB2: SB3.2 U3.26(PB2)
PB3: SB16.1 U3.56(PB3)
PB4: R87.2
PB5: R82.2 U3.58(PB5)
PB6: R84.2
PB7: R81.2 U3.60(PB7)
PB8: R83.2 U3.61(PB8-BOOT0)
PB9: U3.62(PB9)
PB10: SB4.2 U3.30(PB10)
PB11: SB26.1 U3.33(PB11)
PC0: U3.8(PC0)
PC1: U3.9(PC1)
PC2: SB33.2 U3.10(PC2)
PC3: SB12.2 U3.11(PC3)
PC4: SB2.2 U3.22(PC4)
PC5: SB6.1 U3.23(PC5)
PC7: R97.1 U3.39(PC7)
PC10: SB24.2 U3.52(PC10)
PC11: SB23.2 U3.53(PC11)
PC12: SB20.2 U3.54(PC12)
PC13: SB5.1 U3.2(PC13)
PD2: SB19.1 U3.55(PD2) ; port PD2
PF0: SB10.1
PF1: SB11.1
T_JTDI: SB28.1 ; port T_JTDI
T_NRST: C16.2 R67.1 U2.1(IO1) U3.7(PG10-NRST) ; port T_NRST
T_SWCLK: SB27.1 ; port T_SWCLK
T_SWDIO: SB29.1 ; port T_SWDIO
T_SWO: SB16.2 ; port T_SWO
T_VCP_RX: SB23.1 ; port T_VCP_RX
T_VCP_TX: SB24.1 ; port T_VCP_TX
USBPD_550mA_PROTECT: SB19.2 ; port USBPD_550mA_PROTECT
USBPD_CC1: R85.2 R94.1 ; port USBPD_CC1
USBPD_CC2: R86.2 R93.1 ; port USBPD_CC2
USBPD_FS_DM: R96.1 ; port USBPD_FS.USBPD_FS_DM  [project net D_N]
USBPD_FS_DP: R95.1 ; port USBPD_FS.USBPD_FS_DP  [project net D_P]
USBPD_VIN: SB33.1 ; port USBPD_VIN
USBPDFS_D_N: R91.2 R96.2 U3.45(PA11)
USBPDFS_D_P: R90.2 R95.2 U3.46(PA12)
NetB1_1: B1.1 B1.2 R67.2
NetB2_5: B2.5(COMMON) R70.2
NetC41_2: C41.2 R97.2 TP4.1
NetR84_1: R84.1 R85.1 U3.59(PB6)
NetR86_1: R86.1 R87.1 U3.57(PB4)
NetR88_2: R88.2 U3.51(PA15)
NetSB10_2: SB10.2 SB35.2 SB36.2 U3.5(PF0_-_OSC_IN)
NetSB11_2: SB11.2 SB34.2 U3.6(PF1_-_OSC_OUT)

### Buses and harness runs
bus PA[0..15] = port PA[0..15]
bus PB[0..15] = port PB[0..15]
bus PC[0..15] = port PC[0..15]
bus PF[0..1] = port PF[0..1]

### Layout directives
differential pair; rule Impedance Constraint [Min = 85.00    Max = 95.00    ]: D_N, D_P, USBPDFS_D_N, USBPDFS_D_P
rule Undefined; rule Matched Net Lengths [Tolerance = 0.2mm]; rule Impedance Constraint [Min = 85.00    Max = 95.00    ]: USBPDFS_D_N, USBPDFS_D_P

### Notes on the sheet
- MICROCONTROLLER
- T_SWDIO and T_SWCLK must be same length and shielded.
- BUCKBOOST_VIN
- (near SB14) BUCKBOOST_VOUT
- I_IN_AVG
- T_SWO
- LED_LEFT_ORANGE
- JOY_DOWN
- BUCK_BLUE_SENSE
- BUCK_RED_SENSE
- BUCK_BLUE_DRIVE
- USBPD_CC2
- USBPD_CC1
- LED_UP_RED
- LED_RIGHT_GREEN
- (near R88) T_SWDIO
- USBPD_DBCC1
- USBPD_DBCC2
- USBPD_FS_DM
- USBPD_FS_DP
- JOY_UP
- (near SB26) BUCKBOOST_P1_DRIVE
- (near SB26) BUCKBOOST_N1_DRIVE
- (near SB26) I_IN_SENSE
- LED_DOWN_BLUE
- (near R88) T_SWCLK
- (near SB26) BUCKBOOST_P2_DRIVE
- (near SB26) BUCKBOOST_N2_DRIVE
- USBPD_VIN
- (near SB12) JOY_LEFT
- (near SB12) JOY_DOWN
- (near SB19) 550mA_PROTECT
- Resistors must be close to MCU with very short and symmetric topology : USB differential pair routed on Top and/or Bottom ( with GND reference on L2 / L3). PA11 and PA12 with the 2 resistors with 55ohms single track constraints.
- USART3_TX
- RC SINUS
- BUCK_RED_DRIVE
- BUCK_GREEN_DRIVE
- (near SB20) USART3_RX
- (near SB20) JOY_SELECT
- LOAD_50%
- NOTE : BOOT0 is configured as PB8 by default thanks to nSWBOOT0 option bit re-programmed at 0
- (near R83) BOOT0
- Parts must be close to MCU. Place on bottom side.
- Parts above must be close to MCU, placed on bottom side
- JOYSTICK FUNCTION
- RC Sinus FUNCTION
- NOTE : During MCU Reset, PA15 will drive the LED_DOWN_BLUE at low luminance
- (thanks to PA15 nternal Pull-up present during T_NRST is low)
- (near TP4) RC Sinus
- RESET FUNCTION
- JOYSTICK
- (near B1) RESET
- R89 resistor to be placed very close to R88 of PA15
- Title:
- Project:
- Size:
- Revision:
- Variant:
- A3
- -
- Date:
- Reference:
- Sheet:
- of
- (in symbol MCD-01584, part A) MCU_IOs; MCU CLK & RST

### Library data of the parts
B1 = MCD-00001: Non-Open Push-Button 0.1A 24V BLACK; Manufacturer_Part_Number: TD-0341; Manufacturer: WEALTHMETAL; Part_Type: Misc; Provided_By: SUBCO; Internal_Part_Number: MCD-00001; ComponentLink1Description: Datasheet; Status: Released; ComponentLink1URL: http://tunmcdsvn.tun.st.com/Component_Datasheet_Library/Trunk/Misc/Wealthmetal_Tact-Switch_TD0341
B2 = MCD-00132: Joystick, 4 dir, 1 OK; Part_Type: Misc; Manufacturer: XIEJIA Electronics; Provided_By: SUBCO; Internal_Part_Number: MCD-00132; Status: Released; Manufacturer_Part_Number: MT-008A; ComponentLink1Description: Datasheet; ComponentLink1URL: http://tunmcdsvn.tun.st.com/Component_Datasheet_Library/Trunk/Misc/Xieja electronics_MT-008A
C10-C13 C15 C16 = MCD-00102: as C35 on sheet Power; Internal_Part_Number: MCD-00102; Status: Released; Package: C0402; ComponentLink1Description: Datasheet; Part_Type: Capacitor; ComponentLink1URL: http://tunmcdsvn.tun.st.com/Component_Datasheet_Library/Trunk/Capacitors/Yageo_Multilayer_Capacitor_X7R_series_100pF_to_22uF
C41 = MCD-01007: Capacitor, MLCC, 10nF, 16V, X7R, 10%, 0603, T=0.8mm; Manufacturer_Part_Number: CC0603KRX7R7BB103; Manufacturer: YAGEO; Provided_By: SUBCO; Internal_Part_Number: MCD-01007; Status: Released; Part_Type: Capacitor; Package: C0603; ComponentLink1Description: Datasheet; ComponentLink1URL: http://tunmcdsvn.tun.st.com/Component_Datasheet_Library/Trunk/Capacitors/Yageo_Multilayer_Capacitor_X7R_series_100pF_to_22uF/
C92 C93 = MCD-00674: Capacitor, MLCC, 6.8pF, 50V, NPO, +-0.25pF, 0402, T=0.5mm; Manufacturer_Part_Number: CC0402CRNPO9BN6R8; Manufacturer: YAGEO; Provided_By: SUBCO; Internal_Part_Number: MCD-00674; Status: Released; Part_Type: Capacitor; Package: C0402; ComponentLink1Description: Datasheet; ComponentLink1URL: http://tunmcdsvn.tun.st.com/Component_Datasheet_Library/Trunk/Capacitors/Yageo_Capacitor_NP0_16V-to-50V
HW20 = MCD-01337: Joystick Blue Hat; Part_Type: Mechanical; Manufacturer_Part_Number: PB-504; Manufacturer: JIUBABA; Provided_By: SUBCO; Internal_Part_Number: MCD-01337; Status: Checked; ComponentLink1Description: Datasheet; ComponentLink1URL: http://tunmcdsvn.tun.st.com/Component_Datasheet_Library/Trunk/Mechanical/JIUBABA_JOYSTICK_HAT_PB-504
HW21 = MCD-00635: Black Hat for switch TD0341X-G01-BLA; Part_Type: Mechanical; Manufacturer_Part_Number: 988.16.09.3.00003_SH-517; Manufacturer: JIUBABA; Provided_By: SUBCO; Internal_Part_Number: MCD-00635; Status: Released; ComponentLink1Description: Datasheet; ComponentLink1URL: http://tunmcdsvn.tun.st.com/Component_Datasheet_Library/Trunk/Mechanical/Jiubaba_HAT_SH-517
LD2 = MCD-01131: LED Blue, 0603 SMD, Forward Voltage Min=2,8V, Max=3,1V; Part_Type: Display; Manufacturer_Part_Number: 19-217-BHC-ZL1M2RY-3T; Manufacturer: EVERLIGHT; Provided_By: SUBCO; Internal_Part_Number: MCD-01131; Status: Footprint available; Package: 0603; ComponentLink1Description: Datasheet; ComponentLink1URL: http://tunmcdsvn.tun.st.com/Component_Datasheet_Library/Trunk/Display/Everlight_SMD-LED-BLUE_19-213BHC-ZK1L2B11X-3T/Everlight_SMD-LED-BLUE_19-217-BHC-ZL1M2RY-3T-V4.pdf
LD3 = MCD-00321: LED, Orange, 0603; Part_Type: Display; Manufacturer_Part_Number: 19-217/S2C-AM2N2VY/3T; Manufacturer: EVERLIGHT; Provided_By: SUBCO; Internal_Part_Number: MCD-00321; Status: Released; Package: LED 0603; ComponentLink1Description: Datasheet; ComponentLink1URL: http://tunmcdsvn.tun.st.com/Component_Datasheet_Library/Trunk/Display/Everlight_SMD-LED-Orange_19-217-S2C-AM2N2VY-3T_V1
LD4 = MCD-00050: as LD6 on sheet Power; Internal_Part_Number: MCD-00050; ComponentLink1Description: Datasheet; Status: Released; ComponentLink1URL: http://tunmcdsvn.tun.st.com/Component_Datasheet_Library/Trunk/Display/Everlight_SMD-LED-GREEN_19-213SYGC-S530-XX-TR8-v3.doc; Package: LED 0603
LD5 = MCD-00049: LED, Red, 0603; Part_Type: Display; Manufacturer_Part_Number: 19-213-R6C-AP1Q2B/3T; Manufacturer: EVERLIGHT; Provided_By: SUBCO; Internal_Part_Number: MCD-00049; Status: Released; Package: LED 0603; ComponentLink1Description: Datasheet; ComponentLink1URL: http://tunmcdsvn.tun.st.com/Component_Datasheet_Library/Trunk/Display/Everlight_SMD-LED-RED_19-213-R6C-AP1Q2B-3T-V3.doc
R67 R70 = MCD-00224: Resistor,100R,0603,1%,1/10W; Manufacturer_Part_Number: RC0603FR-07100RL; Manufacturer: YAGEO; Provided_By: SUBCO; Internal_Part_Number: MCD-00224; Status: Released; Part_Type: Resistor; Package: R0603; ComponentLink1Description: Datasheet; ComponentLink1URL: http://tunmcdsvn.tun.st.com/Component_Datasheet_Library/Trunk/Resistors/Yageo_Resistor_RC0603-series
R80 R82 = MCD-00070: Resistor,1K,0603,1%,1/10W; Manufacturer_Part_Number: RC0603FR-071KL; Manufacturer: YAGEO; Provided_By: SUBCO; Internal_Part_Number: MCD-00070; Status: Released; Part_Type: Resistor; Package: R0603; ComponentLink1Description: Datasheet; ComponentLink1URL: http://tunmcdsvn.tun.st.com/Component_Datasheet_Library/Trunk/Resistors/Yageo_Resistor_RC0603-series
R81 = MCD-00197: as R92 on sheet Power; Internal_Part_Number: MCD-00197; Status: Released; Part_Type: Resistor; Package: R0603; ComponentLink1Description: Datasheet; ComponentLink1URL: http://tunmcdsvn.tun.st.com/Component_Datasheet_Library/Trunk/Resistors/Yageo_Resistor_RC0603-series
R83 = MCD-00220: Resistor,10K,0603,1%,1/10W; Manufacturer_Part_Number: RC0603FR-0710KL; Manufacturer: YAGEO; Provided_By: SUBCO; Internal_Part_Number: MCD-00220; ComponentLink1Description: Datasheet; Status: Released; Part_Type: Resistor; Package: R0603; ComponentLink1URL: http://tunmcdsvn.tun.st.com/Component_Datasheet_Library/Trunk/Resistors/Yageo_Resistor_RC0603-series
R84-R87 R90 R91 R93-R96 = MCD-00052: Resistor,0R,0402,5%,1/16W; Manufacturer_Part_Number: RC0402JR-070RL; Manufacturer: YAGEO; Provided_By: SUBCO; Internal_Part_Number: MCD-00052; Status: Released; Part_Type: Resistor; Package: R0402; ComponentLink1Description: Datasheet; ComponentLink1URL: http://tunmcdsvn.tun.st.com/Component_Datasheet_Library/Trunk/Resistors/Yageo_Resistor_RC0402-series
R88 = MCD-00481: Resistor,47R,0402,1%,1/16W; Manufacturer_Part_Number: RC0402FR-0747RL; Manufacturer: YAGEO; Provided_By: SUBCO; Internal_Part_Number: MCD-00481; Status: Released; Part_Type: Resistor; Package: R0402; ComponentLink1Description: Datasheet; ComponentLink1URL: http://tunmcdsvn.tun.st.com/Component_Datasheet_Library/Trunk/Resistors/Yageo_Resistor_RC0402-series
R89 = MCD-00354: Resistor,470R,0603,1%,1/10W; Manufacturer_Part_Number: RC0603FR-07470RL; Manufacturer: YAGEO; BMS_Part_Number: 9129906; Provided_By: SUBCO; Internal_Part_Number: MCD-00354; Status: Released; Part_Type: Resistor; Package: R0603; ComponentLink1Description: Datasheet; ComponentLink1URL: http://tunmcdsvn.tun.st.com/Component_Datasheet_Library/Trunk/Resistors/Yageo_Resistor_RC0603-series
R97 = MCD-00341: Resistor,15K,0603,1%,1/10W; Manufacturer_Part_Number: RC0603FR-0715KL; Manufacturer: YAGEO; Provided_By: SUBCO; Internal_Part_Number: MCD-00341; Status: Released; Part_Type: Resistor; Package: R0603; ComponentLink1Description: Datasheet; ComponentLink1URL: http://tunmcdsvn.tun.st.com/Component_Datasheet_Library/Trunk/Resistors/Yageo_Resistor_RC0603-series
SB2-SB6 SB10-SB12 SB14 SB16 SB19 SB20 SB23 SB24 SB26 SB27 SB29 SB33 = MCD-00071: as SB30 on sheet Power; Internal_Part_Number: MCD-00071; Status: Released; Package: SB0603; ComponentLink1Description: Datasheet; ComponentLink1URL: http://tunmcdsvn.tun.st.com/Component_Datasheet_Library/Trunk/Resistors/Yageo_Resistor_RC0603-series
SB13 SB28 SB34-SB36 = MCD-00072: Solder Bridge OFF; Part_Type: Mechanical; Manufacturer_Part_Number: RC0603JR-070RL; Manufacturer: YAGEO; Provided_By: SUBCO; Internal_Part_Number: MCD-00072; Status: Released; Package: SB0603; ComponentLink1Description: Datasheet; ComponentLink1URL: http://tunmcdsvn.tun.st.com/Component_Datasheet_Library/Trunk/Resistors/Yageo_Resistor_RC0603-series
TP4 = MCD-01506: Test Point trought hole 1mm/2mm; Part_Type: Mechanical; Internal_Part_Number: MCD-01506; Status: Released; Manufacturer_Part_Number: n/a; Manufacturer: n/a; ComponentLink1Description: Datasheet; ComponentLink1URL: n/a; Provided_By: n/a
U1 = MCD-01066: 5 unidirectional Transil diodes ESD protection; Part_Type: Diode; Manufacturer: STMICROELECTRONICS; BMS_Part_Number: 9179044; Provided_By: SUBCO with ST control; Internal_Part_Number: MCD-01066; Status: Released; Manufacturer_Part_Number: ESDA6V1-5SC6; Package: SOT23-6L; ComponentLink1Description: Datasheet; ComponentLink1URL: http://tunmcdsvn.tun.st.com/Component_Datasheet_Library/Trunk/Diodes/STM_ESD_ESDA6V1_5SC6
U2 = MCD-00170: ESD protection 6V1; Part_Type: Diode; Manufacturer: STMICROELECTRONICS; BMS_Part_Number: 9151132; Provided_By: SUBCO with ST control; Internal_Part_Number: MCD-00170; Status: Released; Manufacturer_Part_Number: ESDALC6V1-1U2; ComponentLink1Description: Datasheet; ComponentLink1URL: http://tunmcdsvn.tun.st.com/Component_Datasheet_Library/Trunk/Diodes/STM_ESD_ESDALC6V1-1U2
U3 = MCD-01584: STM32G474RET6U MCU, LQFP64 10x10, 1.6, 512KB Flash, 128KB SRAM; Part_Type: IC; Manufacturer: STMICROELECTRONICS; ECCN_US: 3A991A2; ECCN_EU: NEC; Provided_By: SUBCO with ST control; Internal_Part_Number: MCD-01584; Value: STM32G474RET6U; Status: Checked; Manufacturer_Part_Number: STM32G474RET6U; Package: LQFP64 10x10 x 1.6; ComponentLink1Description: Datasheet; ComponentLink1URL: http://tunmcdsvn.tun.st.com/Component_Datasheet_Library/Trunk/IC/STM_MCU_STM32G474RET6U/STM_MCU_STM32G474RET6U.pdf
X2 = MCD-01036: Crystal 24MHz, 6pF, +-20ppm, 80ohms max, SMD; Part_Type: Crystal_Osc; Manufacturer_Part_Number: NX2016SA 24MHz EXS00A-CS10820; Manufacturer: NDK; BMS_Part_Number: 9157045; Provided_By: SUBCO; Internal_Part_Number: MCD-01036; Status: Checked; Package: (2016) 2.0 x 1.6 x 0.45 mm; ComponentLink1Description: Datasheet; ComponentLink1URL: http://tunmcdsvn.tun.st.com/Component_Datasheet_Library/Trunk/Crystal_Osc/NDK_NX2016SA 24MHz EXS00A-CS10820 (EXS10B-27366B); Order_Code_Digikey: 644-1365